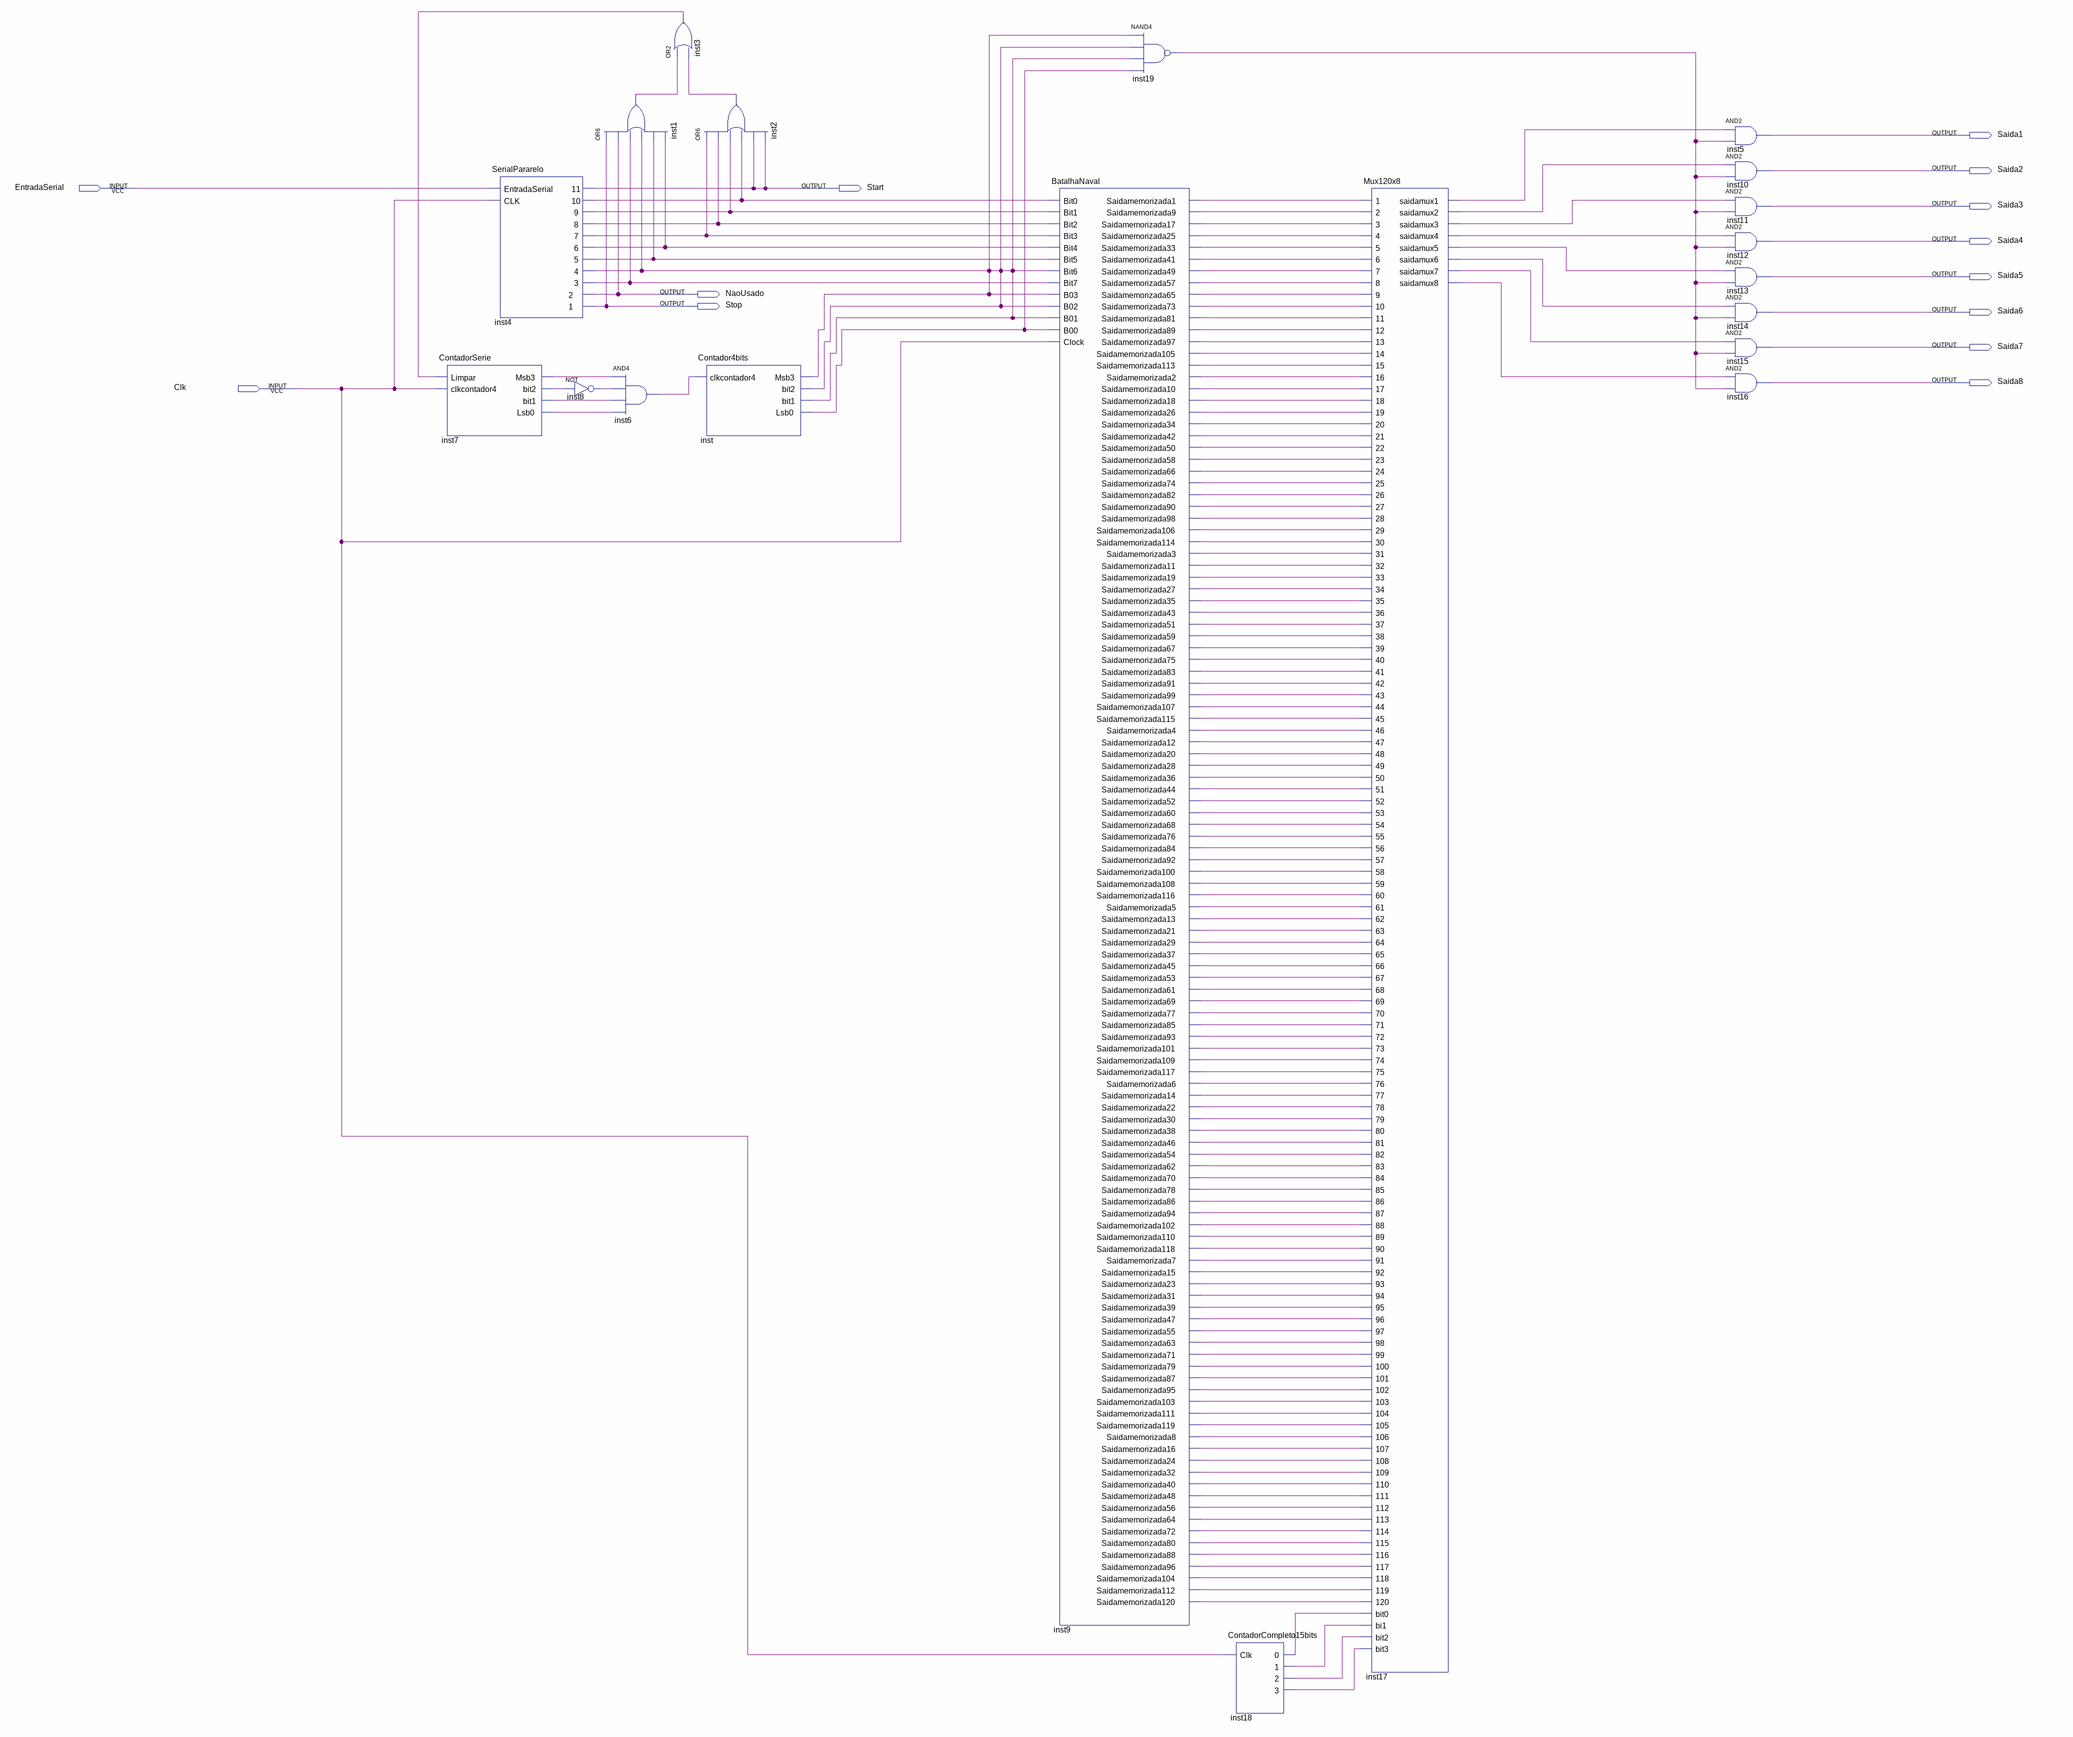
[diagram p0: schematic sheet]
// Quartus schematic ModoGravacao.bdf as structural Verilog: 20 symbols, 13 pins
module ModoGravacao (
  input  EntradaSerial,
  input  Clk,
  output Saida1,
  output Saida2,
  output Start,
  output Saida3,
  output Saida4,
  output Saida5,
  output NaoUsado,
  output Stop,
  output Saida6,
  output Saida7,
  output Saida8
);

  wire inst1_out, inst2_out, inst3_out, inst4_3, inst4_4, inst4_5, inst4_6, inst4_7, inst4_8, inst4_9,
       inst4_10, inst6_out, inst7_bit1, inst7_bit2, inst7_lsb0, inst7_msb3, inst8_out,
       inst9_saidamemorizada1, inst9_saidamemorizada2, inst9_saidamemorizada3, inst9_saidamemorizada4,
       inst9_saidamemorizada5, inst9_saidamemorizada6, inst9_saidamemorizada7, inst9_saidamemorizada8,
       inst9_saidamemorizada9, inst9_saidamemorizada10, inst9_saidamemorizada11, inst9_saidamemorizada12,
       inst9_saidamemorizada13, inst9_saidamemorizada14, inst9_saidamemorizada15, inst9_saidamemorizada16,
       inst9_saidamemorizada17, inst9_saidamemorizada18, inst9_saidamemorizada19, inst9_saidamemorizada20,
       inst9_saidamemorizada21, inst9_saidamemorizada22, inst9_saidamemorizada23, inst9_saidamemorizada24,
       inst9_saidamemorizada25, inst9_saidamemorizada26, inst9_saidamemorizada27, inst9_saidamemorizada28,
       inst9_saidamemorizada29, inst9_saidamemorizada30, inst9_saidamemorizada31, inst9_saidamemorizada32,
       inst9_saidamemorizada33, inst9_saidamemorizada34, inst9_saidamemorizada35, inst9_saidamemorizada36,
       inst9_saidamemorizada37, inst9_saidamemorizada38, inst9_saidamemorizada39, inst9_saidamemorizada40,
       inst9_saidamemorizada41, inst9_saidamemorizada42, inst9_saidamemorizada43, inst9_saidamemorizada44,
       inst9_saidamemorizada45, inst9_saidamemorizada46, inst9_saidamemorizada47, inst9_saidamemorizada48,
       inst9_saidamemorizada49, inst9_saidamemorizada50, inst9_saidamemorizada51, inst9_saidamemorizada52,
       inst9_saidamemorizada53, inst9_saidamemorizada54, inst9_saidamemorizada55, inst9_saidamemorizada56,
       inst9_saidamemorizada57, inst9_saidamemorizada58, inst9_saidamemorizada59, inst9_saidamemorizada60,
       inst9_saidamemorizada61, inst9_saidamemorizada62, inst9_saidamemorizada63, inst9_saidamemorizada64,
       inst9_saidamemorizada65, inst9_saidamemorizada66, inst9_saidamemorizada67, inst9_saidamemorizada68,
       inst9_saidamemorizada69, inst9_saidamemorizada70, inst9_saidamemorizada71, inst9_saidamemorizada72,
       inst9_saidamemorizada73, inst9_saidamemorizada74, inst9_saidamemorizada75, inst9_saidamemorizada76,
       inst9_saidamemorizada77, inst9_saidamemorizada78, inst9_saidamemorizada79, inst9_saidamemorizada80,
       inst9_saidamemorizada81, inst9_saidamemorizada82, inst9_saidamemorizada83, inst9_saidamemorizada84,
       inst9_saidamemorizada85, inst9_saidamemorizada86, inst9_saidamemorizada87, inst9_saidamemorizada88,
       inst9_saidamemorizada89, inst9_saidamemorizada90, inst9_saidamemorizada91, inst9_saidamemorizada92,
       inst9_saidamemorizada93, inst9_saidamemorizada94, inst9_saidamemorizada95, inst9_saidamemorizada96,
       inst9_saidamemorizada97, inst9_saidamemorizada98, inst9_saidamemorizada99, inst9_saidamemorizada100,
       inst9_saidamemorizada101, inst9_saidamemorizada102, inst9_saidamemorizada103,
       inst9_saidamemorizada104, inst9_saidamemorizada105, inst9_saidamemorizada106,
       inst9_saidamemorizada107, inst9_saidamemorizada108, inst9_saidamemorizada109,
       inst9_saidamemorizada110, inst9_saidamemorizada111, inst9_saidamemorizada112,
       inst9_saidamemorizada113, inst9_saidamemorizada114, inst9_saidamemorizada115,
       inst9_saidamemorizada116, inst9_saidamemorizada117, inst9_saidamemorizada118,
       inst9_saidamemorizada119, inst9_saidamemorizada120, inst17_saidamux1, inst17_saidamux2,
       inst17_saidamux3, inst17_saidamux4, inst17_saidamux5, inst17_saidamux6, inst17_saidamux7,
       inst17_saidamux8, inst18_0, inst18_1, inst18_2, inst18_3, inst19_out, inst_lsb0;

  ContadorSerie inst7 (
    .Limpar(inst3_out), .clkcontador4(Clk), .Msb3(inst7_msb3), .bit2(inst7_bit2), .bit1(inst7_bit1),
    .Lsb0(inst7_lsb0));
  SerialPararelo inst4 (
    .EntradaSerial(EntradaSerial), .CLK(Clk), .\11 (Start), .\10 (inst4_10), .\1 (Stop), .\2 (NaoUsado),
    .\3 (inst4_3), .\4 (inst4_4), .\5 (inst4_5), .\6 (inst4_6), .\7 (inst4_7), .\8 (inst4_8), .\9 (inst4_9));
  or inst1 (inst1_out, Stop, NaoUsado, inst4_3, inst4_4, inst4_5, inst4_6);
  not inst8 (inst8_out, inst7_bit2);
  and inst6 (inst6_out, inst7_msb3, inst8_out, inst7_bit1, inst7_lsb0);
  or inst3 (inst3_out, inst1_out, inst2_out);
  or inst2 (inst2_out, inst4_7, inst4_8, inst4_9, inst4_10, Start, Start);
  Contador4bits inst (.clkcontador4(inst6_out), .Msb3(inst4_4), .bit2(inst4_4), .bit1(inst4_4), .Lsb0(inst_lsb0));
  BatalhaNaval inst9 (
    .Bit0(inst4_10), .Bit1(inst4_9), .Bit2(inst4_8), .Bit3(inst4_7), .Bit4(inst4_6), .Bit5(inst4_5),
    .Bit6(inst4_4), .Bit7(inst4_3), .B03(inst4_4), .B02(inst4_4), .B01(inst4_4), .B00(inst_lsb0),
    .Clock(Clk), .Saidamemorizada1(inst9_saidamemorizada1), .Saidamemorizada9(inst9_saidamemorizada9),
    .Saidamemorizada17(inst9_saidamemorizada17), .Saidamemorizada25(inst9_saidamemorizada25),
    .Saidamemorizada33(inst9_saidamemorizada33), .Saidamemorizada41(inst9_saidamemorizada41),
    .Saidamemorizada49(inst9_saidamemorizada49), .Saidamemorizada57(inst9_saidamemorizada57),
    .Saidamemorizada65(inst9_saidamemorizada65), .Saidamemorizada73(inst9_saidamemorizada73),
    .Saidamemorizada81(inst9_saidamemorizada81), .Saidamemorizada89(inst9_saidamemorizada89),
    .Saidamemorizada97(inst9_saidamemorizada97), .Saidamemorizada105(inst9_saidamemorizada105),
    .Saidamemorizada113(inst9_saidamemorizada113), .Saidamemorizada2(inst9_saidamemorizada2),
    .Saidamemorizada10(inst9_saidamemorizada10), .Saidamemorizada18(inst9_saidamemorizada18),
    .Saidamemorizada26(inst9_saidamemorizada26), .Saidamemorizada34(inst9_saidamemorizada34),
    .Saidamemorizada42(inst9_saidamemorizada42), .Saidamemorizada50(inst9_saidamemorizada50),
    .Saidamemorizada58(inst9_saidamemorizada58), .Saidamemorizada66(inst9_saidamemorizada66),
    .Saidamemorizada74(inst9_saidamemorizada74), .Saidamemorizada82(inst9_saidamemorizada82),
    .Saidamemorizada90(inst9_saidamemorizada90), .Saidamemorizada98(inst9_saidamemorizada98),
    .Saidamemorizada106(inst9_saidamemorizada106), .Saidamemorizada114(inst9_saidamemorizada114),
    .Saidamemorizada3(inst9_saidamemorizada3), .Saidamemorizada11(inst9_saidamemorizada11),
    .Saidamemorizada19(inst9_saidamemorizada19), .Saidamemorizada27(inst9_saidamemorizada27),
    .Saidamemorizada35(inst9_saidamemorizada35), .Saidamemorizada43(inst9_saidamemorizada43),
    .Saidamemorizada51(inst9_saidamemorizada51), .Saidamemorizada59(inst9_saidamemorizada59),
    .Saidamemorizada67(inst9_saidamemorizada67), .Saidamemorizada75(inst9_saidamemorizada75),
    .Saidamemorizada83(inst9_saidamemorizada83), .Saidamemorizada91(inst9_saidamemorizada91),
    .Saidamemorizada99(inst9_saidamemorizada99), .Saidamemorizada107(inst9_saidamemorizada107),
    .Saidamemorizada115(inst9_saidamemorizada115), .Saidamemorizada4(inst9_saidamemorizada4),
    .Saidamemorizada12(inst9_saidamemorizada12), .Saidamemorizada20(inst9_saidamemorizada20),
    .Saidamemorizada28(inst9_saidamemorizada28), .Saidamemorizada36(inst9_saidamemorizada36),
    .Saidamemorizada44(inst9_saidamemorizada44), .Saidamemorizada52(inst9_saidamemorizada52),
    .Saidamemorizada60(inst9_saidamemorizada60), .Saidamemorizada68(inst9_saidamemorizada68),
    .Saidamemorizada76(inst9_saidamemorizada76), .Saidamemorizada84(inst9_saidamemorizada84),
    .Saidamemorizada92(inst9_saidamemorizada92), .Saidamemorizada100(inst9_saidamemorizada100),
    .Saidamemorizada108(inst9_saidamemorizada108), .Saidamemorizada116(inst9_saidamemorizada116),
    .Saidamemorizada5(inst9_saidamemorizada5), .Saidamemorizada13(inst9_saidamemorizada13),
    .Saidamemorizada21(inst9_saidamemorizada21), .Saidamemorizada29(inst9_saidamemorizada29),
    .Saidamemorizada37(inst9_saidamemorizada37), .Saidamemorizada45(inst9_saidamemorizada45),
    .Saidamemorizada53(inst9_saidamemorizada53), .Saidamemorizada61(inst9_saidamemorizada61),
    .Saidamemorizada69(inst9_saidamemorizada69), .Saidamemorizada77(inst9_saidamemorizada77),
    .Saidamemorizada85(inst9_saidamemorizada85), .Saidamemorizada93(inst9_saidamemorizada93),
    .Saidamemorizada101(inst9_saidamemorizada101), .Saidamemorizada109(inst9_saidamemorizada109),
    .Saidamemorizada117(inst9_saidamemorizada117), .Saidamemorizada6(inst9_saidamemorizada6),
    .Saidamemorizada14(inst9_saidamemorizada14), .Saidamemorizada22(inst9_saidamemorizada22),
    .Saidamemorizada30(inst9_saidamemorizada30), .Saidamemorizada38(inst9_saidamemorizada38),
    .Saidamemorizada46(inst9_saidamemorizada46), .Saidamemorizada54(inst9_saidamemorizada54),
    .Saidamemorizada62(inst9_saidamemorizada62), .Saidamemorizada70(inst9_saidamemorizada70),
    .Saidamemorizada78(inst9_saidamemorizada78), .Saidamemorizada86(inst9_saidamemorizada86),
    .Saidamemorizada94(inst9_saidamemorizada94), .Saidamemorizada102(inst9_saidamemorizada102),
    .Saidamemorizada110(inst9_saidamemorizada110), .Saidamemorizada118(inst9_saidamemorizada118),
    .Saidamemorizada7(inst9_saidamemorizada7), .Saidamemorizada15(inst9_saidamemorizada15),
    .Saidamemorizada23(inst9_saidamemorizada23), .Saidamemorizada31(inst9_saidamemorizada31),
    .Saidamemorizada39(inst9_saidamemorizada39), .Saidamemorizada47(inst9_saidamemorizada47),
    .Saidamemorizada55(inst9_saidamemorizada55), .Saidamemorizada63(inst9_saidamemorizada63),
    .Saidamemorizada71(inst9_saidamemorizada71), .Saidamemorizada79(inst9_saidamemorizada79),
    .Saidamemorizada87(inst9_saidamemorizada87), .Saidamemorizada95(inst9_saidamemorizada95),
    .Saidamemorizada103(inst9_saidamemorizada103), .Saidamemorizada111(inst9_saidamemorizada111),
    .Saidamemorizada119(inst9_saidamemorizada119), .Saidamemorizada8(inst9_saidamemorizada8),
    .Saidamemorizada16(inst9_saidamemorizada16), .Saidamemorizada24(inst9_saidamemorizada24),
    .Saidamemorizada32(inst9_saidamemorizada32), .Saidamemorizada40(inst9_saidamemorizada40),
    .Saidamemorizada48(inst9_saidamemorizada48), .Saidamemorizada56(inst9_saidamemorizada56),
    .Saidamemorizada64(inst9_saidamemorizada64), .Saidamemorizada72(inst9_saidamemorizada72),
    .Saidamemorizada80(inst9_saidamemorizada80), .Saidamemorizada88(inst9_saidamemorizada88),
    .Saidamemorizada96(inst9_saidamemorizada96), .Saidamemorizada104(inst9_saidamemorizada104),
    .Saidamemorizada112(inst9_saidamemorizada112), .Saidamemorizada120(inst9_saidamemorizada120));
  nand inst19 (inst19_out, inst4_4, inst4_4, inst4_4, inst_lsb0);
  ContadorCompleto15bits inst18 (.Clk(Clk), .\0 (inst18_0), .\1 (inst18_1), .\2 (inst18_2), .\3 (inst18_3));
  Mux120x8 inst17 (
    .\1 (inst9_saidamemorizada1), .\2 (inst9_saidamemorizada9), .\3 (inst9_saidamemorizada17),
    .\4 (inst9_saidamemorizada25), .\5 (inst9_saidamemorizada33), .\6 (inst9_saidamemorizada41),
    .\7 (inst9_saidamemorizada49), .\8 (inst9_saidamemorizada57), .\9 (inst9_saidamemorizada65),
    .\10 (inst9_saidamemorizada73), .\11 (inst9_saidamemorizada81), .\12 (inst9_saidamemorizada89),
    .\13 (inst9_saidamemorizada97), .\14 (inst9_saidamemorizada105), .\15 (inst9_saidamemorizada113),
    .\16 (inst9_saidamemorizada2), .\17 (inst9_saidamemorizada10), .\18 (inst9_saidamemorizada18),
    .\19 (inst9_saidamemorizada26), .\20 (inst9_saidamemorizada34), .\21 (inst9_saidamemorizada42),
    .\22 (inst9_saidamemorizada50), .\23 (inst9_saidamemorizada58), .\24 (inst9_saidamemorizada66),
    .\25 (inst9_saidamemorizada74), .\26 (inst9_saidamemorizada82), .\27 (inst9_saidamemorizada90),
    .\28 (inst9_saidamemorizada98), .\29 (inst9_saidamemorizada106), .\30 (inst9_saidamemorizada114),
    .\31 (inst9_saidamemorizada3), .\32 (inst9_saidamemorizada11), .\33 (inst9_saidamemorizada19),
    .\34 (inst9_saidamemorizada27), .\35 (inst9_saidamemorizada35), .\36 (inst9_saidamemorizada43),
    .\37 (inst9_saidamemorizada51), .\38 (inst9_saidamemorizada59), .\39 (inst9_saidamemorizada67),
    .\40 (inst9_saidamemorizada75), .\41 (inst9_saidamemorizada83), .\42 (inst9_saidamemorizada91),
    .\43 (inst9_saidamemorizada99), .\44 (inst9_saidamemorizada107), .\45 (inst9_saidamemorizada115),
    .\46 (inst9_saidamemorizada4), .\47 (inst9_saidamemorizada12), .\48 (inst9_saidamemorizada20),
    .\49 (inst9_saidamemorizada28), .\50 (inst9_saidamemorizada36), .\51 (inst9_saidamemorizada44),
    .\52 (inst9_saidamemorizada52), .\53 (inst9_saidamemorizada60), .\54 (inst9_saidamemorizada68),
    .\55 (inst9_saidamemorizada76), .\56 (inst9_saidamemorizada84), .\57 (inst9_saidamemorizada92),
    .\58 (inst9_saidamemorizada100), .\59 (inst9_saidamemorizada108), .\60 (inst9_saidamemorizada116),
    .\61 (inst9_saidamemorizada5), .\62 (inst9_saidamemorizada13), .\63 (inst9_saidamemorizada21),
    .\64 (inst9_saidamemorizada29), .\65 (inst9_saidamemorizada37), .\66 (inst9_saidamemorizada45),
    .\67 (inst9_saidamemorizada53), .\68 (inst9_saidamemorizada61), .\69 (inst9_saidamemorizada69),
    .\70 (inst9_saidamemorizada77), .\71 (inst9_saidamemorizada85), .\72 (inst9_saidamemorizada93),
    .\73 (inst9_saidamemorizada101), .\74 (inst9_saidamemorizada109), .\75 (inst9_saidamemorizada117),
    .\76 (inst9_saidamemorizada6), .\77 (inst9_saidamemorizada14), .\78 (inst9_saidamemorizada22),
    .\79 (inst9_saidamemorizada30), .\80 (inst9_saidamemorizada38), .\81 (inst9_saidamemorizada46),
    .\82 (inst9_saidamemorizada54), .\83 (inst9_saidamemorizada62), .\84 (inst9_saidamemorizada70),
    .\85 (inst9_saidamemorizada78), .\86 (inst9_saidamemorizada86), .\87 (inst9_saidamemorizada94),
    .\88 (inst9_saidamemorizada102), .\89 (inst9_saidamemorizada110), .\90 (inst9_saidamemorizada118),
    .\91 (inst9_saidamemorizada7), .\92 (inst9_saidamemorizada15), .\93 (inst9_saidamemorizada23),
    .\94 (inst9_saidamemorizada31), .\95 (inst9_saidamemorizada39), .\96 (inst9_saidamemorizada47),
    .\97 (inst9_saidamemorizada55), .\98 (inst9_saidamemorizada63), .\99 (inst9_saidamemorizada71),
    .\100 (inst9_saidamemorizada79), .\101 (inst9_saidamemorizada87), .\102 (inst9_saidamemorizada95),
    .\103 (inst9_saidamemorizada103), .\104 (inst9_saidamemorizada111), .\105 (inst9_saidamemorizada119),
    .\106 (inst9_saidamemorizada8), .\107 (inst9_saidamemorizada16), .\108 (inst9_saidamemorizada24),
    .\109 (inst9_saidamemorizada32), .\110 (inst9_saidamemorizada40), .\111 (inst9_saidamemorizada48),
    .\112 (inst9_saidamemorizada56), .\113 (inst9_saidamemorizada64), .\114 (inst9_saidamemorizada72),
    .\115 (inst9_saidamemorizada80), .\116 (inst9_saidamemorizada88), .\117 (inst9_saidamemorizada96),
    .\118 (inst9_saidamemorizada104), .\119 (inst9_saidamemorizada112), .\120 (inst9_saidamemorizada120),
    .bit0(inst18_0), .bi1(inst18_1), .bit2(inst18_2), .bit3(inst18_3), .saidamux1(inst17_saidamux1),
    .saidamux2(inst17_saidamux2), .saidamux3(inst17_saidamux3), .saidamux4(inst17_saidamux4),
    .saidamux5(inst17_saidamux5), .saidamux6(inst17_saidamux6), .saidamux7(inst17_saidamux7),
    .saidamux8(inst17_saidamux8));
  and inst5 (Saida1, inst17_saidamux1, inst19_out);
  and inst10 (Saida2, inst17_saidamux2, inst19_out);
  and inst11 (Saida3, inst17_saidamux3, inst19_out);
  and inst12 (Saida4, inst17_saidamux4, inst19_out);
  and inst13 (Saida5, inst17_saidamux5, inst19_out);
  and inst14 (Saida6, inst17_saidamux6, inst19_out);
  and inst15 (Saida7, inst17_saidamux7, inst19_out);
  and inst16 (Saida8, inst17_saidamux8, inst19_out);
endmodule
